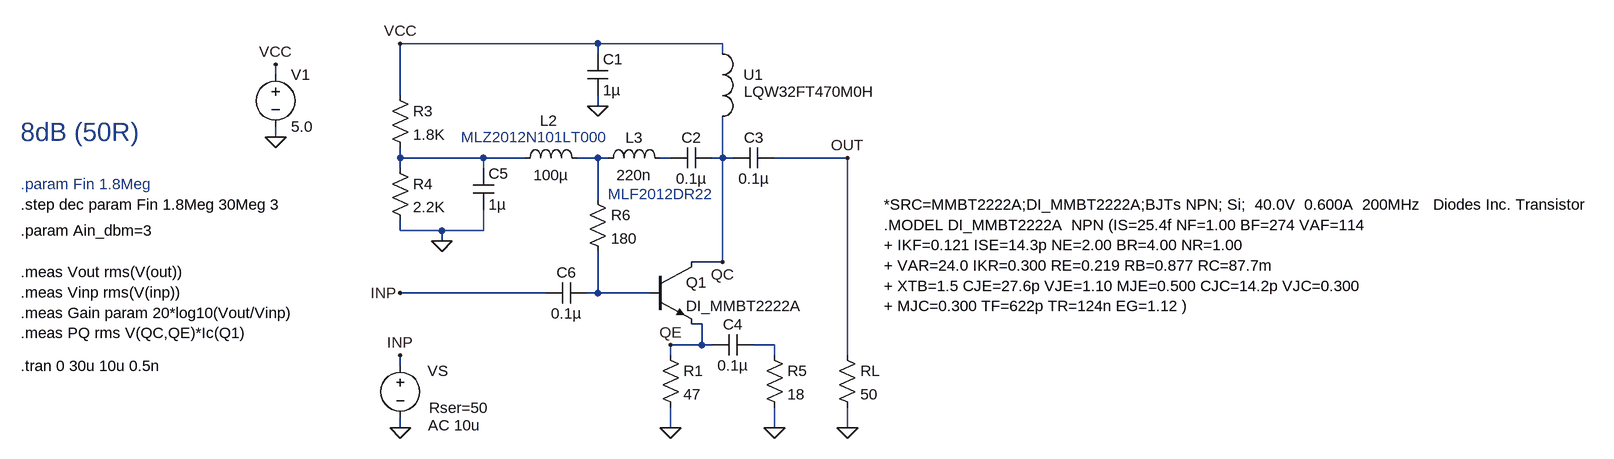
[diagram p0: schematic pre-amp.asc]
pre-amp.asc, the LTspice schematic file:
Version 4
SHEET 1 1756 680
WIRE 160 -304 -144 -304
WIRE 352 -304 160 -304
WIRE 160 -288 160 -304
WIRE 352 -288 352 -304
WIRE -336 -256 -336 -272
WIRE -144 -224 -144 -304
WIRE 160 -208 160 -224
WIRE -336 -160 -336 -176
WIRE -144 -128 -144 -144
WIRE -16 -128 -144 -128
WIRE 48 -128 -16 -128
WIRE 160 -128 128 -128
WIRE 176 -128 160 -128
WIRE 272 -128 256 -128
WIRE 352 -128 352 -192
WIRE 352 -128 336 -128
WIRE 368 -128 352 -128
WIRE 544 -128 432 -128
WIRE -144 -112 -144 -128
WIRE -16 -112 -16 -128
WIRE 160 -64 160 -128
WIRE -144 -16 -144 -32
WIRE -80 -16 -144 -16
WIRE -16 -16 -16 -48
WIRE -16 -16 -80 -16
WIRE -80 0 -80 -16
WIRE 352 32 352 -128
WIRE 352 32 304 32
WIRE 80 80 -144 80
WIRE 160 80 160 16
WIRE 160 80 144 80
WIRE 240 80 160 80
WIRE 320 128 304 128
WIRE 320 160 320 128
WIRE 320 160 272 160
WIRE 336 160 320 160
WIRE 432 160 400 160
WIRE 272 176 272 160
WIRE 432 176 432 160
WIRE 544 176 544 -128
WIRE -144 192 -144 176
WIRE -144 288 -144 272
WIRE 272 288 272 256
WIRE 432 288 432 256
WIRE 544 288 544 256
FLAG -144 288 0
FLAG 160 -208 0
FLAG 272 288 0
FLAG -144 -304 VCC
FLAG -336 -160 0
FLAG -336 -272 VCC
FLAG 544 288 0
FLAG 544 -128 OUT
FLAG -80 0 0
FLAG 432 288 0
FLAG -144 176 INP
FLAG -144 80 INP
FLAG 272 160 QE
FLAG 352 32 QC
SYMBOL res 528 160 R0
SYMATTR InstName RL
SYMATTR Value 50
SYMBOL cap 144 -288 R0
SYMATTR InstName C1
SYMATTR Value 1µ
SYMBOL voltage -336 -272 R0
WINDOW 123 0 0 Left 0
WINDOW 39 0 0 Left 0
SYMATTR InstName V1
SYMATTR Value 5.0
SYMBOL cap 432 -144 R90
WINDOW 0 0 32 VBottom 2
WINDOW 3 32 32 VTop 2
SYMATTR InstName C3
SYMATTR Value 0.1µ
SYMBOL cap 336 -144 R90
WINDOW 0 0 32 VBottom 2
WINDOW 3 32 32 VTop 2
SYMATTR InstName C2
SYMATTR Value 0.1µ
SYMBOL res 256 160 R0
SYMATTR InstName R1
SYMATTR Value 47
SYMBOL res -160 -240 R0
SYMATTR InstName R3
SYMATTR Value 1.8K
SYMBOL res -160 -128 R0
SYMATTR InstName R4
SYMATTR Value 2.2K
SYMBOL cap -32 -112 R0
SYMATTR InstName C5
SYMATTR Value 1µ
SYMBOL ind 32 -112 R270
WINDOW 0 58 53 VTop 2
WINDOW 3 5 56 VBottom 2
SYMATTR InstName L2
SYMATTR Value 100µ
SYMATTR SpiceLine Ipk=30m Rser=3.5 Rpar=55K Cpar=1.169p
SYMBOL cap 144 64 R90
WINDOW 0 0 32 VBottom 2
WINDOW 3 32 32 VTop 2
SYMATTR InstName C6
SYMATTR Value 0.1µ
SYMBOL voltage -144 176 R0
WINDOW 0 42 24 Left 2
WINDOW 3 45 55 Invisible 2
WINDOW 123 43 108 Left 2
WINDOW 39 44 81 Left 2
SYMATTR InstName VS
SYMATTR Value SINE(0 {2.83*sqrt(5e-2*pow(10, Ain_dbm/10))} {Fin})
SYMATTR Value2 AC 10u
SYMATTR SpiceLine Rser=50
SYMBOL npn 240 32 R0
SYMATTR InstName Q1
SYMATTR Value DI_MMBT2222A
SYMBOL cap 400 144 R90
WINDOW 0 0 32 VBottom 2
WINDOW 3 32 32 VTop 2
SYMATTR InstName C4
SYMATTR Value 0.1µ
SYMBOL res 416 160 R0
SYMATTR InstName R5
SYMATTR Value 18
SYMBOL res 144 -80 R0
SYMATTR InstName R6
SYMATTR Value 180
SYMBOL ind 160 -112 R270
WINDOW 0 32 56 VTop 2
WINDOW 3 5 56 VBottom 2
SYMATTR InstName L3
SYMATTR Value 220n
SYMATTR SpiceLine Ipk=250m Rser=0.16 Rpar=1K Cpar= 1.057p
SYMBOL LQW32FT470M0H 352 -240 R90
WINDOW 0 -16 -32 VLeft 2
WINDOW 3 10 -33 VLeft 2
SYMATTR InstName U1
TEXT -728 192 Left 2 !.tran 0 30u 10u 0.5n
TEXT -728 -168 Left 4 ;8dB (50R)
TEXT 64 -160 Center 2 ;MLZ2012N101LT000
TEXT -728 -56 Left 2 !.step dec param Fin 1.8Meg 30Meg 3
TEXT -728 48 Left 2 !.meas Vout rms(V(out))\n.meas Vinp rms(V(inp))\n.meas Gain param 20*log10(Vout/Vinp)\n.meas PQ rms V(QC,QE)*Ic(Q1)
TEXT -728 -88 Left 2 ;.param Fin 1.8Meg
TEXT 600 -56 Left 2 !*SRC=MMBT2222A;DI_MMBT2222A;BJTs NPN; Si;  40.0V  0.600A  200MHz   Diodes Inc. Transistor \n.MODEL DI_MMBT2222A  NPN (IS=25.4f NF=1.00 BF=274 VAF=114 \n+ IKF=0.121 ISE=14.3p NE=2.00 BR=4.00 NR=1.00 \n+ VAR=24.0 IKR=0.300 RE=0.219 RB=0.877 RC=87.7m \n+ XTB=1.5 CJE=27.6p VJE=1.10 MJE=0.500 CJC=14.2p VJC=0.300 \n+ MJC=0.300 TF=622p TR=124n EG=1.12 )
TEXT -728 -16 Left 2 !.param Ain_dbm=3
TEXT 176 -72 Left 2 ;MLF2012DR22

The netlist it stands for:
* pre-amp.asc
RL OUT 0 50
C1 VCC 0 1µ
V1 VCC 0 5.0
C3 OUT QC 0.1µ
C2 QC N003 0.1µ
R1 QE 0 47
R3 VCC N001 1.8K
R4 N001 0 2.2K
C5 N001 0 1µ
L2 N001 N002 100µ Ipk=30m Rser=3.5 Rpar=55K Cpar=1.169p
C6 N004 INP 0.1µ
VS INP 0 SINE(0 {2.83*sqrt(5e-2*pow(10, Ain_dbm/10))} {Fin}) AC 10u Rser=50
Q1 QC N004 QE 0 DI_MMBT2222A
C4 N005 QE 0.1µ
R5 N005 0 18
R6 N002 N004 180
L3 N002 N003 220n Ipk=250m Rser=0.16 Rpar=1K Cpar= 1.057p
XU1 VCC QC LQW32FT470M0H  ; pins port1 port2
.model NPN NPN
.model PNP PNP
.lib standard.bjt
.tran 0 30u 10u 0.5n
* 8dB (50R)
* MLZ2012N101LT000
.step dec param Fin 1.8Meg 30Meg 3
.meas Vout rms(V(out))
.meas Vinp rms(V(inp))
.meas Gain param 20*log10(Vout/Vinp)
.meas PQ rms V(QC,QE)*Ic(Q1)
* .param Fin 1.8Meg
*SRC=MMBT2222A;DI_MMBT2222A;BJTs NPN; Si;  40.0V  0.600A  200MHz   Diodes Inc. Transistor
.MODEL DI_MMBT2222A  NPN (IS=25.4f NF=1.00 BF=274 VAF=114
+ IKF=0.121 ISE=14.3p NE=2.00 BR=4.00 NR=1.00
+ VAR=24.0 IKR=0.300 RE=0.219 RB=0.877 RC=87.7m
+ XTB=1.5 CJE=27.6p VJE=1.10 MJE=0.500 CJC=14.2p VJC=0.300
+ MJC=0.300 TF=622p TR=124n EG=1.12 )
.param Ain_dbm=3
* MLF2012DR22
.lib LQW32FT470M0H.mod
.backanno
.end